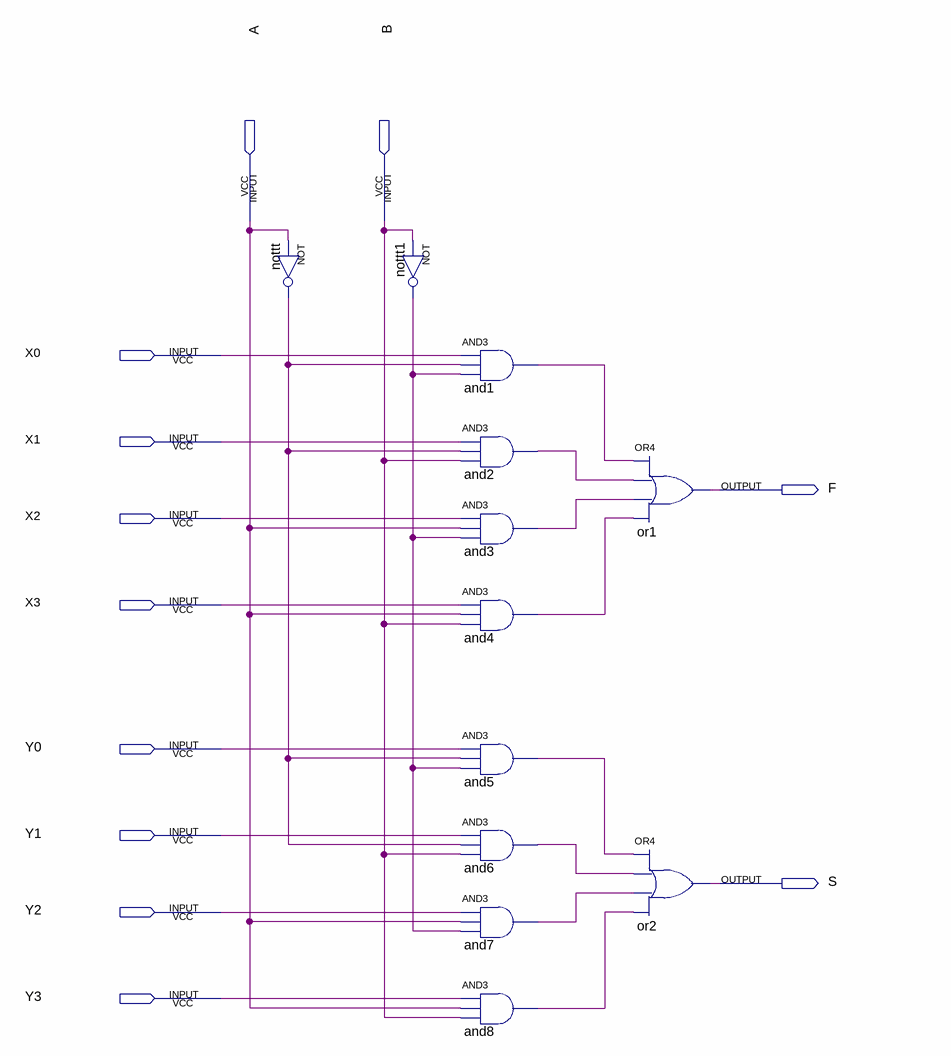
[diagram p0: schematic sheet]
// Quartus schematic BlockDuplu4x1.bdf as structural Verilog: 12 symbols, 12 pins
module BlockDuplu4x1 (
  input  A,
  input  B,
  input  X0,
  input  X1,
  input  X2,
  input  X3,
  input  Y0,
  input  Y1,
  input  Y2,
  input  Y3,
  output F,
  output S
);

  wire and1_out, and2_out, and3_out, and4_out, and5_out, and6_out, and7_out, and8_out, nottt1_out, nottt_out;

  not nottt (nottt_out, A);
  not nottt1 (nottt1_out, B);
  and and1 (and1_out, X0, nottt_out, nottt1_out);
  and and2 (and2_out, X1, nottt_out, B);
  and and3 (and3_out, X2, A, nottt1_out);
  and and4 (and4_out, X3, A, B);
  and and5 (and5_out, Y0, nottt_out, nottt1_out);
  and and6 (and6_out, Y1, nottt_out, B);
  and and7 (and7_out, Y2, A, nottt1_out);
  and and8 (and8_out, Y3, A, B);
  or or1 (F, and1_out, and2_out, and3_out, and4_out);
  or or2 (S, and5_out, and6_out, and7_out, and8_out);
endmodule
